# EAGLE design Clock-Divider-4040 (EAGLE 9.2.0)
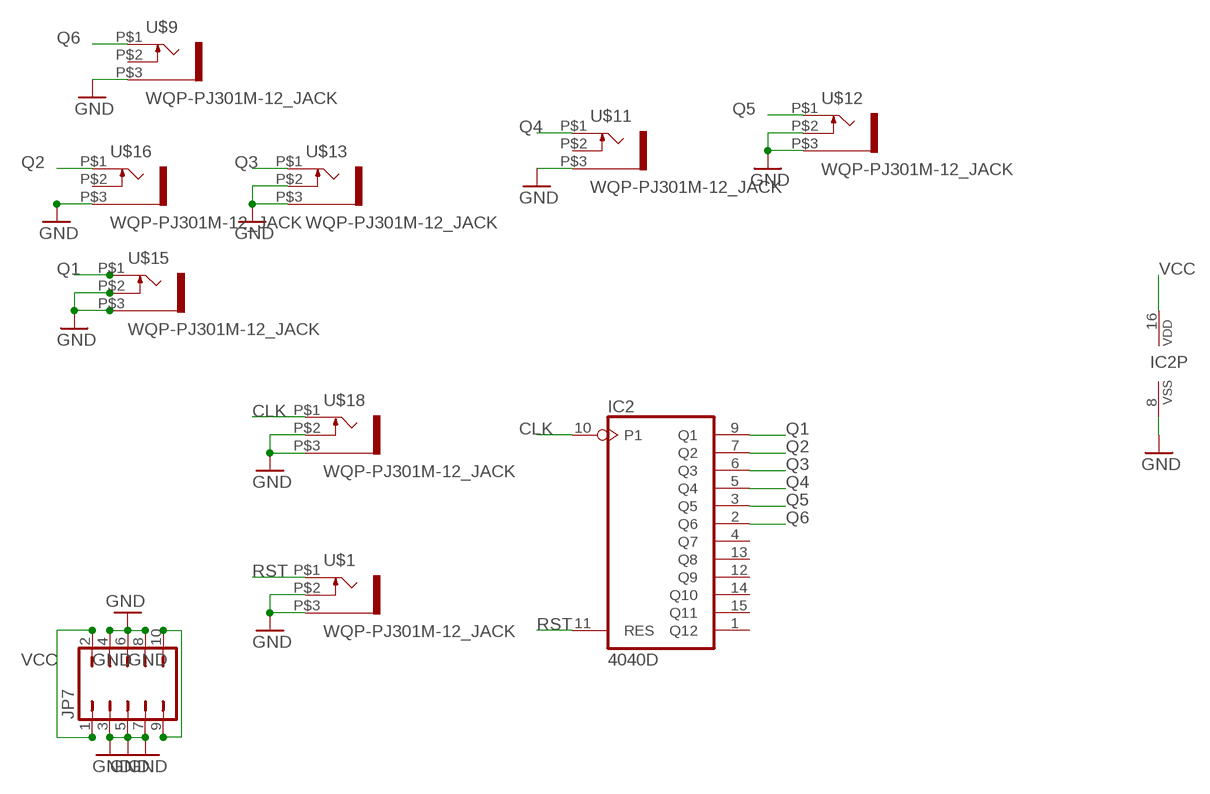
[diagram p0: schematic, sheet 1]

## Parts
IC2  4040D  [SO16]
JP7  JP5Q  [JP5Q]
U$1  WQP-PJ301M-12_JACK  [WQP-PJ301M-12_JACK]
U$9  WQP-PJ301M-12_JACK  [WQP-PJ301M-12_JACK]
U$11  WQP-PJ301M-12_JACK  [WQP-PJ301M-12_JACK]
U$12  WQP-PJ301M-12_JACK  [WQP-PJ301M-12_JACK]
U$13  WQP-PJ301M-12_JACK  [WQP-PJ301M-12_JACK]
U$15  WQP-PJ301M-12_JACK  [WQP-PJ301M-12_JACK]
U$16  WQP-PJ301M-12_JACK  [WQP-PJ301M-12_JACK]
U$18  WQP-PJ301M-12_JACK  [WQP-PJ301M-12_JACK]

## Nets
CLK: IC2.10(P1) U$18.P$1
GND: IC2.8(VSS) JP7.3 JP7.4 JP7.5 JP7.6 JP7.7 JP7.8 U$1.P$2 U$1.P$3 U$9.P$3 U$11.P$3 U$12.P$2 U$12.P$3 U$13.P$2 U$13.P$3 U$15.P$2 U$15.P$3 U$16.P$3 U$18.P$2 U$18.P$3
N$6: JP7.9 JP7.10
Q1: IC2.9(Q1) U$15.P$1
Q2: IC2.7(Q2) U$16.P$1
Q3: IC2.6(Q3) U$13.P$1
Q4: IC2.5(Q4) U$11.P$1
Q5: IC2.3(Q5) U$12.P$1
Q6: IC2.2(Q6) U$9.P$1
RST: IC2.11(RES) U$1.P$1
VCC: IC2.16(VDD) JP7.1 JP7.2
Unconnected: IC2.1(Q12) IC2.4(Q7) IC2.12(Q9) IC2.13(Q8) IC2.14(Q10) IC2.15(Q11) U$9.P$2 U$11.P$2 U$16.P$2

## Library data of the parts
IC2 = 40xx:4040: 12-stage binary/ripple COUNTER
JP7 = jumper:JP5Q: JUMPER
U$1 U$9 U$11-U$13 U$15 U$16 U$18 = thonkiconn:WQP-PJ301M-12_JACK

## Board
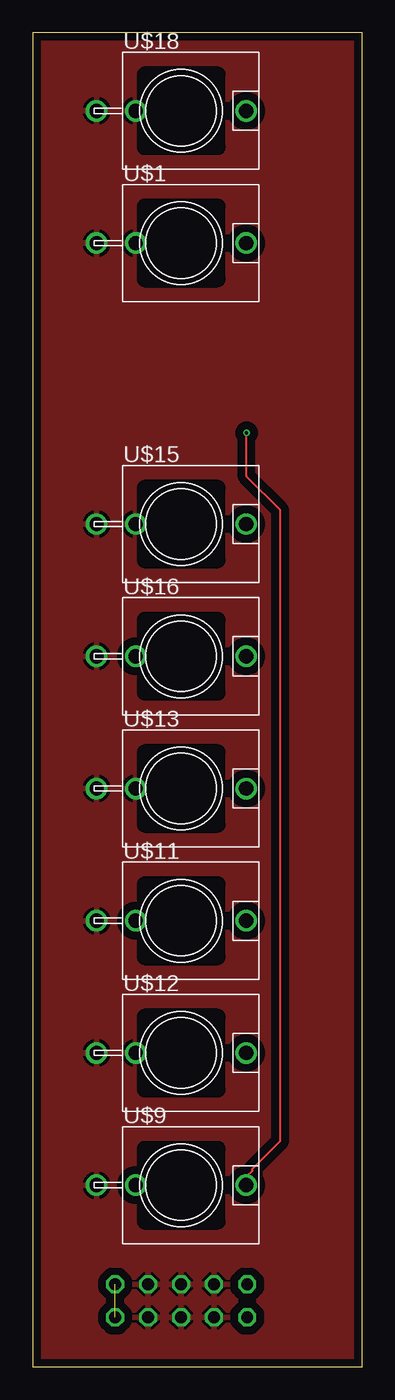
[diagram p1: board, top side]
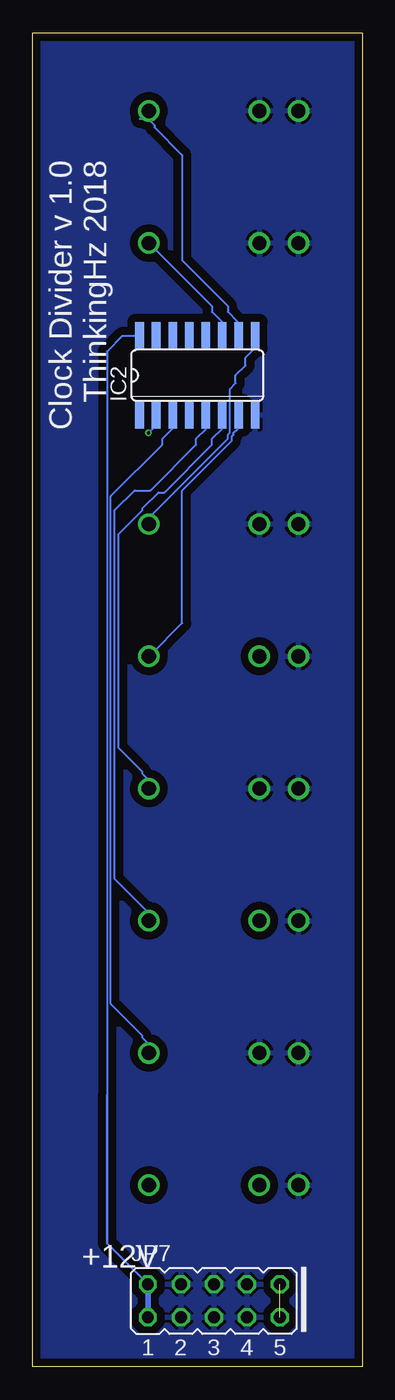
[diagram p2: board, bottom side, seen from below]

Size 25.38 x 102.54 mm. Coordinates in mm from the lower left corner, seen from the top.
Outline: 0,0 25.38,0 25.38,102.54 0,102.54 0,0
Copper layers (1*16): Top 0.035559375mm / dielectric 1.6mm / Bottom 0.035559375mm
Design rules "oshpark-2layer": minimum track width 6mil, minimum drill 10mil, track to track 6mil, track to pad 6mil, pad to pad 6mil, via to via 6mil, smd to smd 6mil, copper to edge 15mil, drill to drill 6mil, minimum pad ring 5mil, minimum via ring 5mil, stop-mask expansion 2.5mil, vias tented up to drill 0mil, thermal gap 10mil

### Footprints (pad centres in the part's own frame; a part is rotated, then mirrored left to right if it is on the bottom)
SO16 = smd 0.66 x 2.032: 1 -4.445,-3.073; 2 -3.175,-3.073; 3 -1.905,-3.073; 4 -0.635,-3.073; 5 0.635,-3.073; 6 1.905,-3.073; 7 3.175,-3.073; 8 4.445,-3.073; 9 4.445,3.073; 10 3.175,3.073; 11 1.905,3.073; 12 0.635,3.073; 13 -0.635,3.073; 14 -1.905,3.073; 15 -3.175,3.073; 16 -4.445,3.073
JP5Q = drill 0.914 octagon: 1 -5.08,-1.27; 2 -5.08,1.27; 3 -2.54,-1.27; 4 -2.54,1.27; 5 0,-1.27; 6 0,1.27; 7 2.54,-1.27; 8 2.54,1.27; 9 5.08,-1.27; 10 5.08,1.27
WQP-PJ301M-12_JACK = drill 1.1: P$1 0,5; P$2 0,-3.5; P$3 0,-6.5

### Placement (x,y rotation side)
IC2  12.7,76.2 0 bottom
JP7  11.43,5.08 0 bottom
U$1  11.43,86.36 270 top
U$9  11.43,13.97 270 top
U$11  11.43,34.29 270 top
U$12  11.43,24.13 270 top
U$13  11.43,44.45 270 top
U$15  11.43,64.77 270 top
U$16  11.43,54.61 270 top
U$18  11.43,96.52 270 top

### Tracks (layer width: path | path; a pad name or v marks a point on that pad's centre or on a via)
CLK
  Bottom 0.152: 17.14,95.89 16.51,95.89 16.51,96.52 U$18.P$1 16.46,96.01 16.31,95.86 16.31,95.71 16,95.4 16,95.25 13.87,93.12 13.87,85.04 10.36,81.53 10.36,81.08 9.6,80.31 9.6,79.4 IC2.10
GND
  pour Top (isolate 0.61): 0,102.87 25.4,102.87 25.4,0 0,0
  pour Bottom (isolate 0.61): 0,102.87 25.4,102.87 25.4,0 0,0
N$6  (1 unrouted)
Q1
  Bottom 0.152: 16.51,64.77 U$15.P$1 16.31,64.77 16.31,65.38 10.36,71.32 10.36,71.63 10.21,71.78 10.21,75.13 9.75,75.59 9.75,76.2 8.99,76.96 8.99,77.57 8.38,78.18 8.38,79.25 IC2.9
Q2
  Bottom 0.152: 16.51,55.24 16.51,54.61 U$16.P$1 16.31,54.71 13.87,57.15 13.87,67.36 10.06,71.17 10.06,71.48 9.91,71.63 9.91,71.78 9.6,72.08 9.6,73 IC2.7
Q3
  Bottom 0.152: 16.51,45.09 16.51,44.45 U$13.P$1 16.46,44.96 16.61,45.11 16.61,45.26 16.92,45.57 16.92,45.72 18.75,47.55 18.75,64.01 16.92,65.84 16.92,65.99 15.7,67.21 15.24,67.21 11.58,70.87 11.58,71.32 10.82,72.08 10.82,73 IC2.6
Q4
  Bottom 0.152: 16.51,34.92 16.51,34.29 U$11.P$1 16.46,34.75 16.61,34.9 16.61,35.05 19.05,37.49 19.05,65.84 17.53,67.36 16.31,67.36 12.8,70.87 12.8,71.32 12.04,72.08 12.04,73 IC2.5
Q5
  Bottom 0.152: 16.51,24.77 16.51,24.13 U$12.P$1 16.46,24.69 16.46,24.84 16.92,25.3 16.92,25.45 19.36,27.89 19.36,66.9 15.39,70.87 15.39,71.32 14.63,72.08 14.63,73 IC2.3
Q6  (via drill 0.25)
  Top 0.152: v16.46,71.78 16.46,68.43 19.05,65.84 19.05,17.37 16.92,15.24 16.92,15.09 16.46,14.63 16.46,14.02 U$9.P$1
  Bottom 0.152: 16.51,14.61 16.51,13.97 U$9.P$1 | v16.46,71.78 16,72.24 16,73 IC2.2
RST
  Bottom 0.152: 16.51,85.72 16.51,86.36 U$1.P$1 16.31,86.26 11.58,81.53 11.58,81.08 10.82,80.31 10.82,79.4 IC2.11
VCC
  Bottom 0.152: 19.66,20.88 19.66,78.03 18.44,79.25 17.22,79.25 IC2.16
  Bottom 0.203: 19.66,20.88 19.66,9.5 JP7.2
  Bottom 0.406: JP7.2 JP7.1

### Text on the board
bNames: Clock Divider v 1.0 / ThinkingHz 2018 | | | +12V